# Altium schematic sheet 5V_REG.SchDoc
size A4; SheetNumber: 4; SheetTotal: 11
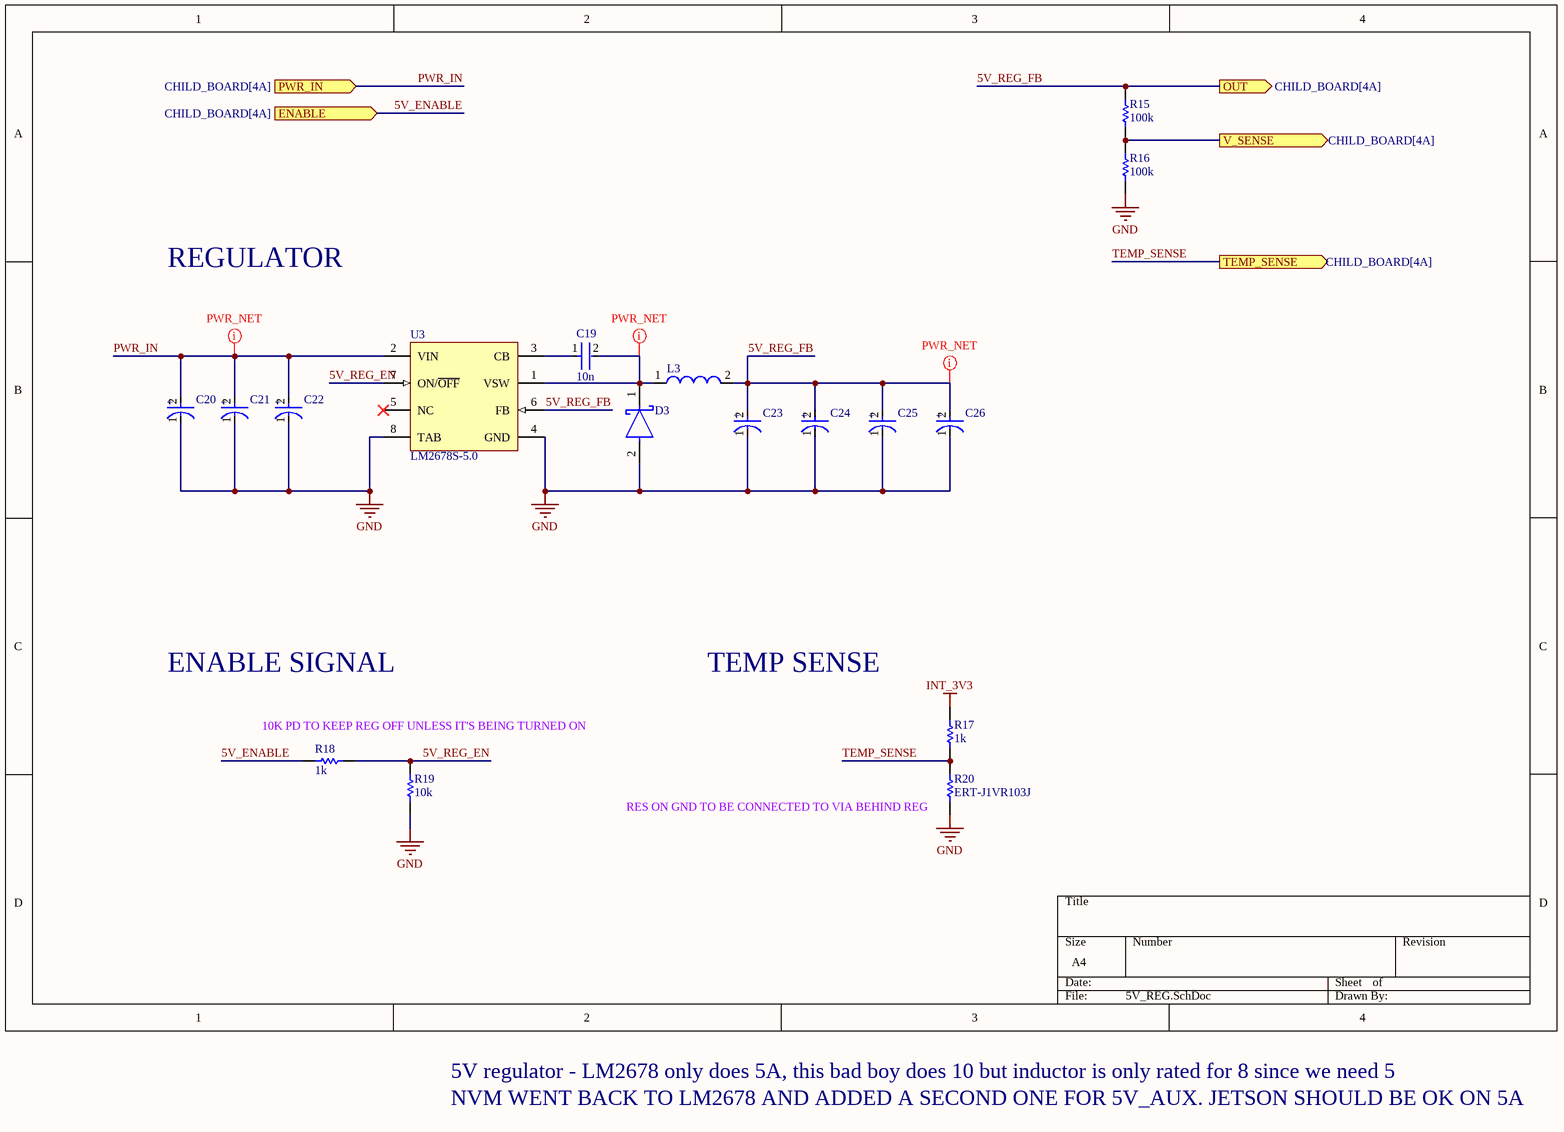
[diagram p0: 5V_REG.SchDoc]

## Parts
C19  10n  [FP-0402-L_1_0_0_05-W_0_5-IPC_A]
C20  20SVP33M  [FP-OS-CON-SMT-E7-MFG]  (value not drawn)
C21  20SVP33M  [FP-OS-CON-SMT-E7-MFG]  (value not drawn)
C22  20SVP33M  [FP-OS-CON-SMT-E7-MFG]  (value not drawn)
C23  EEE-1AA101WR  [FP-SC-MFG]  (value not drawn)
C24  EEE-1AA101WR  [FP-SC-MFG]  (value not drawn)
C25  EEE-1AA101WR  [FP-SC-MFG]  (value not drawn)
C26  EEE-1AA101WR  [FP-SC-MFG]  (value not drawn)
D3  B540C-13-F  [FP-SMC-MFG]  (value not drawn)
L3  74477110  [WE-PD-L]  (value not drawn)
R15  100k  [R0603B]
R16  100k  [R0603B]
R17  1k  [R0603B]
R18  1k  [R0603B]
R19  10k  [R0603B]
R20  ERT-J1VR103J  [RESC1608X90X30ML15T20]
U3  LM2678S-5.0  [KTW0007B_N]

## Ports
ENABLE (in, see CHILD_BOARD[4A]), OUT (out, see CHILD_BOARD[4A]), PWR_IN (in, see CHILD_BOARD[4A]), TEMP_SENSE (out, see CHILD_BOARD[4A]), V_SENSE (out, see CHILD_BOARD[4A])

## Nets
GND: C20.1(C) C21.1(C) C22.1(C) C23.1(C) C24.1(C) C25.1(C) C26.1(C) D3.2(A) R16.2 R19.2 R20.1 U3.4(GND) U3.8(TAB)
INT_3V3: R17.1
5V_ENABLE: R18.2 ; port ENABLE
5V_REG_EN: R18.1 R19.1 U3.7(ON/~{OFF})
5V_REG_FB: C23.2(A) C24.2(A) C25.2(A) C26.2(A) L3.2 R15.1 U3.6(FB) ; port OUT
PWR_IN: C20.2(A) C21.2(A) C22.2(A) U3.2(VIN) ; port PWR_IN
TEMP_SENSE: R17.2 R20.2 ; port TEMP_SENSE
V_SENSE: R15.2 R16.1 ; port V_SENSE
NetC19_1: C19.1 U3.3(CB)
NetC19_2: C19.2 D3.1(C) L3.1 U3.1(VSW)

Not connected (* = marked no-connect by the designer): U3 5(NC)*

## Layout directives
net class PWR: 5V_REG_FB, NetC19_2, PWR_IN

## Notes on the sheet
- REGULATOR
- ENABLE SIGNAL
- TEMP SENSE
- 10K PD TO KEEP REG OFF UNLESS IT'S BEING TURNED ON
- RES ON GND TO BE CONNECTED TO VIA BEHIND REG
- 5V regulator - LM2678 only does 5A, this bad boy does 10 but inductor is only rated for 8 since we need 5
- NVM WENT BACK TO LM2678 AND ADDED A SECOND ONE FOR 5V_AUX. JETSON SHOULD BE OK ON 5A
- (in symbol CMP-05427-000047-1) +
- (in symbol CMP-05428-001387-1) +

## Library data of the parts
C19 = CMP-001-00058-1: LARGE PADS, 0402 CAP, CHANGE COMMENT TO MATCH REAL P/N; Capacitor Type: Ceramic; Min Operating Temperature: -55°C; Mounting Technology: Surface Mount; Pins: 2; Case/Package: 0402; RoHS Compliant: Yes; Max Operating Temperature: 85°C
C20-C22 = CMP-05428-001387-1: Conductive Polymer Aluminum Solid Capacitors (OS-CON) 33uF ±20% 20V RADIAL SMT 8x6.9mm; Polarity: Polar; Life (Hours): 2000Hour; Leakage Current: 132uA; ESR (Equivalent Series Resistance): 45mR; Ripple Current (AC): 1.89A; Dissipation Factor: 12%; Construction: Cylindrical; Capacitance: 33uF; Max Operating Temperature: 105°C; Min Operating Temperature: -55°C; Voltage: 20V; Number of Pins: 7; Termination: SMD/SMT; Package Quantity: 1000; Packaging: Tape and Reel; REACH SVHC: No SVHC; Mount: Surface Mount; Tolerance: 20%; Voltage Rating (DC): 20V; Height: 6.9mm; Series: OS-CON™, SVP; Diameter: 8mm; Length: 6.9mm; Ripple Current: 1.89A; RoHS Compliant: Yes; Height - Seated (Max): 0.276inch; Case/Package: Radial; Voltage Rating: 20V
C23-C26 = CMP-05427-000047-1: CAP ALUM 100UF 20% 10V SMD; Life (Hours): 1000Hour; Ripple Current: 50mA; Packaging: Tape and Reel; Diameter: 5mm; Voltage Rating (DC): 10V; Mount: Surface Mount; Max Operating Temperature: 85°C; Length: 5.5mm; Case/Package: Radial; Height: 5.4mm; Construction: Cylindrical; Termination: SMD/SMT; Height - Seated (Max): 0.213inch; Series: S; Min Operating Temperature: -40°C; Capacitance: 100uF; Tolerance: 20%; Voltage Rating: 10V; Package Quantity: 1; Radiation Hardening: No; Ripple Current (AC): 50mA; Lead Free: Lead Free; RoHS Compliant: Yes; Contact Plating: Tin
D3 = CMP-2000-05097-3: DIODE SCHOTTKY 40V 5A SMC; Manufacturer: Diodes Inc.; Automotive Grade: NA; Peak Reverse Current: 0.5mA; Value: 300pF; Max Junction Temp: +150°C; Max Surge Forward Current: 100A; Standoff Height: 0.1mm; Digikey Description: DIODE SCHOTTKY 40V 5A SMC; Temperature Range Low: -55°C; Manufacturer Part Number: B540C-13-F; Octopart: https://octopart.com/b540c-13-f-diodes+inc.-325873; Lead Free: Yes; Reverse Voltage: 40V; RoHS: TRUE; Category: Diode; Mouser Description: Diode: Schottky rectifying; SMD; 40V; 5A; SMC; Package: reel, tape; ComponentLink2Description: Datasheet; Temperature Range High: +150°C; Automotive: No; Footprint Url: https://www.diodes.com/assets/Package-Files/SMC.pdf; Device Class L3: Schottky Diodes; Height: 2.5mm; Forward Current: 5A; Temperature: -55°C to +150°C; Package: SMC; ComponentLink2URL: https://www.diodes.com/assets/Datasheets/ds13012.pdf; Device Class L2: Diodes; Max Repetitive Reverse Voltage: 40V; Device Class L1: Discrete Semiconductors; Capacitance: 300pF
L3 = CMP-0227-00708-1: SMD-Shielded Power Inductor WE-PD, L = 10.0 µH; Inductance: 10.0 ÂµH; ComponentLink2Description: Datasheet; DatasheetVersion: ver 7, Sep-2006; PackageVersion: 2006; ComponentLink1URL: http://www.we-online.com; ComponentLink1Description: Manufacturer Link; ComponentLink2URL: http://www.we-online.de/katalog/media/pdf/74477110.pdf; PackageDescription: SMD Inductor, 2-Leads, Body 12.0 x 12.0 mm; PackageReference: WE-PD-L
R15-R19 = CMP-009-00002-14: Resistor
  R15 R16: Value: 100k
  R17 R18: Value: 1k
  R19: Value: 10k
R20 = CMP-2000-00869-1: Manufacturer: Panasonic; Part Number: ERT-J1VR103J
U3 = CMP-0069-00190-3: SIMPLE SWITCHER® High Efficiency 5A Step-Down Voltage Regulator, 7-pin TO-263; Manufacturer: Texas Instruments; PowerWise: N; PackageTopMarking: NSUZXYTTE#*LM2678*S-5.0; RoHS: N; PinCount: 7; Code_JEDEC: MO-169-AC; ComponentLink1URL: http://www.ti.com/general/docs/lit/getliterature.tsp?genericPartNumber=LM2678&fileType=pdf; ComponentLink1Description: Datasheet URL; PackageReference: KTW0007B; PackageDescription: TO-263, Molded, .400 x .390 x .180in Body, 7 Lead, .050in Pitch, Surface Mount; CompType: Switcher